# EAGLE design entireboard_v2_4layer (EAGLE 9.3.0)

## Sheet 1 of 2
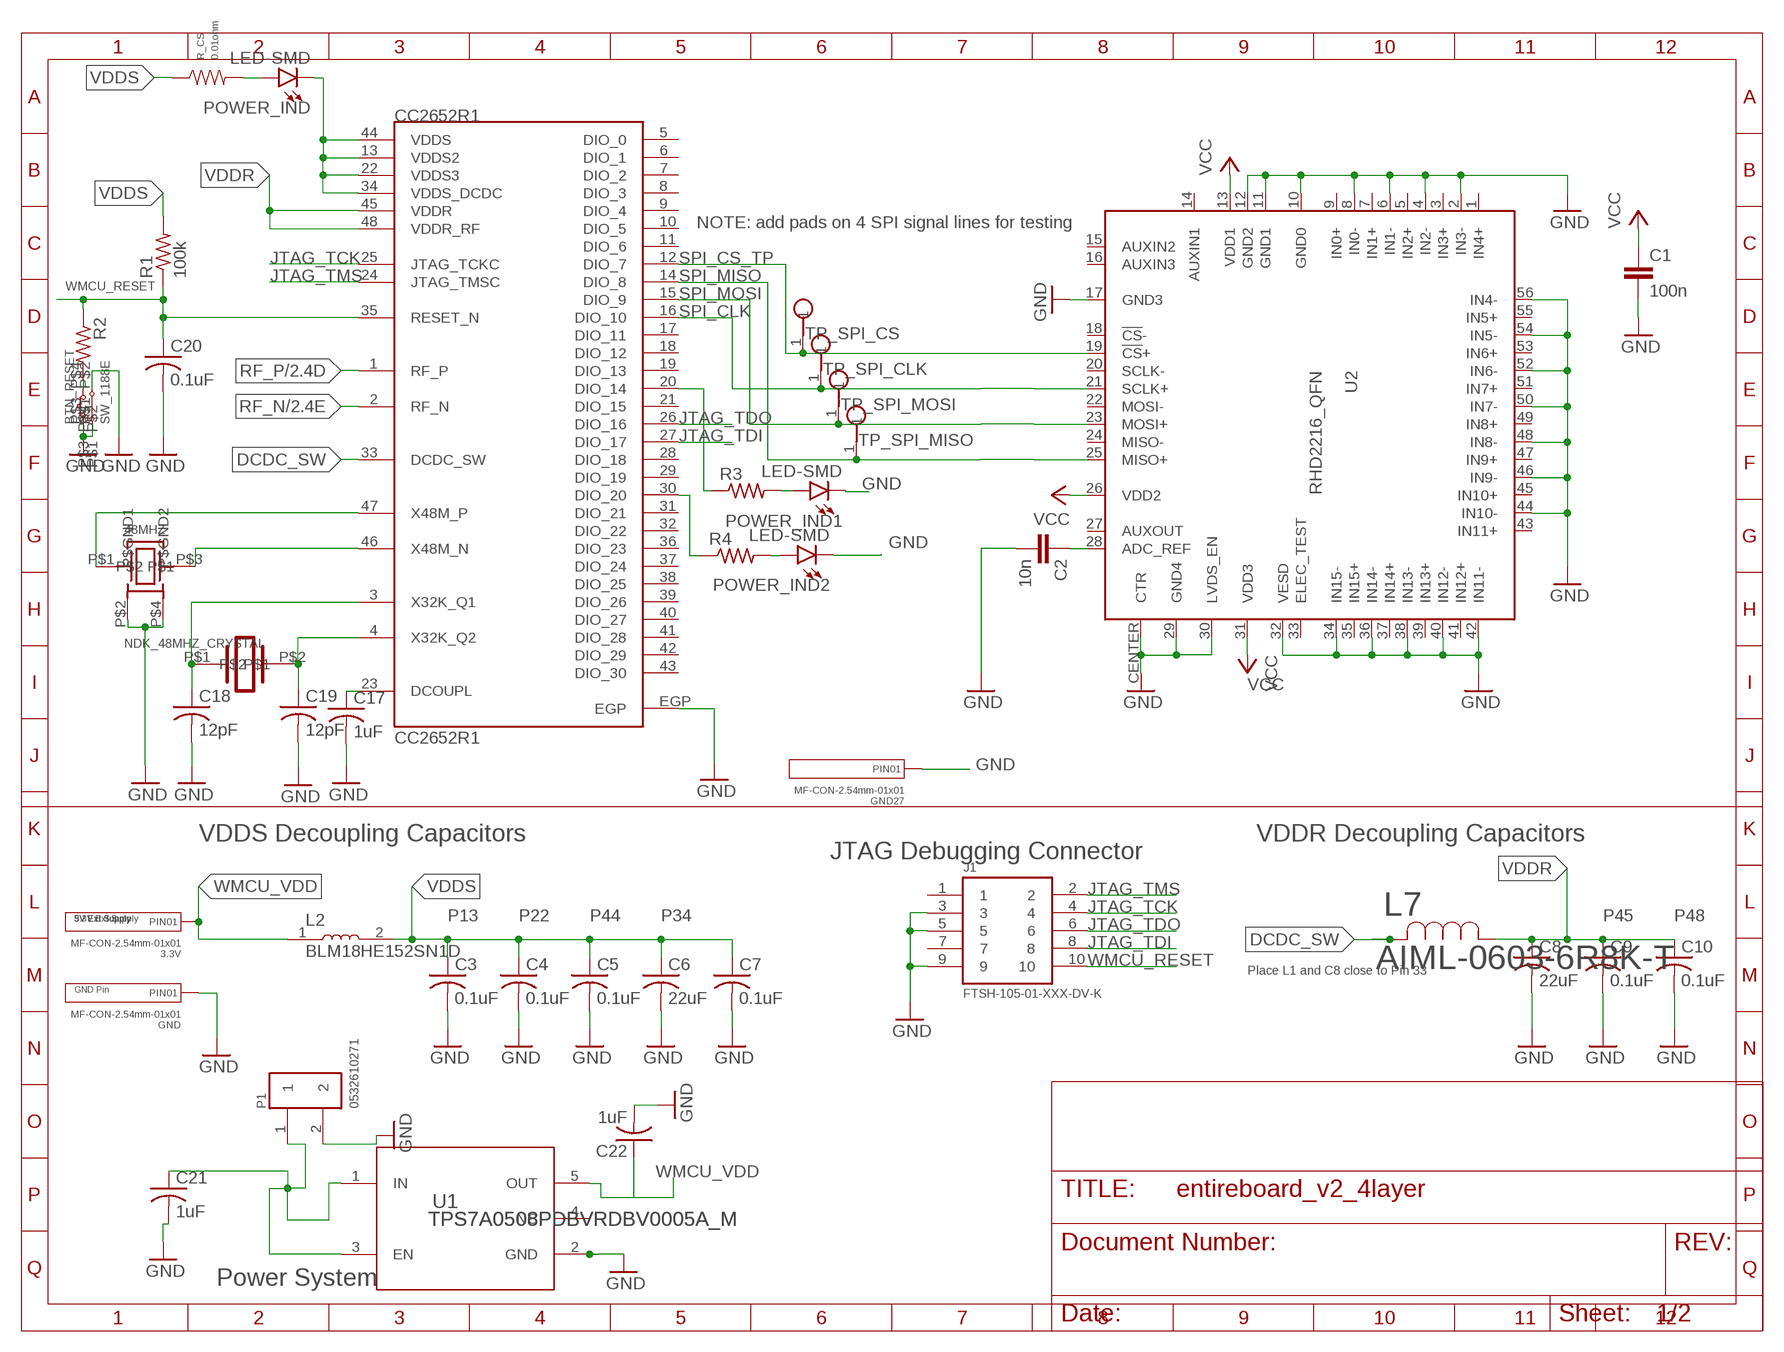
[diagram p0: schematic, sheet 1]

### Parts
3.3V  MF-CON-2.54mm-01x01  CON_01X01_PTH_2.54MM  [PTH_2.54MM_01X01]
38.768KHZ  EPSON_32.768KHZ_CRYSTAL  [2-SMD]
48MHZ  NDK_48MHZ_CRYSTAL  [4-SMD]
BTN_RESET  SW_1188E  [SW_1188E]
C1  100n  C_0402  [0402]
C2  10n  C_0402  [0402]
C3  0.1uF  C-USC0402  [C0402]
C4  0.1uF  C-USC0402  [C0402]
C5  0.1uF  C-USC0402  [C0402]
C6  22uF  C-USC0402  [C0402]
C7  0.1uF  C-USC0402  [C0402]
C8  22uF  C-USC0402  [C0402]
C9  0.1uF  C-USC0402  [C0402]
C10  0.1uF  C-USC0402  [C0402]
C17  1uF  C-USC0402  [C0402]
C18  12pF  C-USC0402  [C0402]
C19  12pF  C-USC0402  [C0402]
C20  0.1uF  C-USC0402  [C0402]
C21  1uF  C-USC0402  [C0402]
C22  1uF  C-USC0402  [C0402]
CC2652R1  CC2652R1  [CC2652R1_QFN-48]
GND  MF-CON-2.54mm-01x01  CON_01X01_PTH_2.54MM  [PTH_2.54MM_01X01]
GND27  MF-CON-2.54mm-01x01  CON_01X01_PTH_2.54MM  [PTH_2.54MM_01X01]
J1  FTSH-105-01-XXX-DV-K  [FTSH-105-01-XXX-DV-K]
L2  BLM18HE152SN1D  [INDC1608X95]
L7  AIML-0603-6R8K-T  [AIML-0603]
P1  0532610271  [MOLEX_0532610271]
POWER_IND  LED-SMD  [RHD2000_EVAL_BOARD_0402]
POWER_IND1  LED-SMD  [RHD2000_EVAL_BOARD_0402]
POWER_IND2  LED-SMD  [RHD2000_EVAL_BOARD_0402]
R1  100k  R-US_R0402  [R0402]
R2  R-US_R0402  [R0402]
R3  R-US_R0402  [R0402]
R4  R-US_R0402  [R0402]
R_CS  0.01ohm  RESISTOR_0402  [R0402]
TP_SPI_CLK  RHD2000_EVAL_BOARD_TESTPOINT_SMALL  [RHD2000_EVAL_BOARD_TESTPOINT_SMALL]
TP_SPI_CS  RHD2000_EVAL_BOARD_TESTPOINT_SMALL  [RHD2000_EVAL_BOARD_TESTPOINT_SMALL]
TP_SPI_MISO  RHD2000_EVAL_BOARD_TESTPOINT_SMALL  [RHD2000_EVAL_BOARD_TESTPOINT_SMALL]
TP_SPI_MOSI  RHD2000_EVAL_BOARD_TESTPOINT_SMALL  [RHD2000_EVAL_BOARD_TESTPOINT_SMALL]
U1  TPS7A0508PDBVRDBV0005A_M  [DBV0005A_M]
U2  RHD2216_QFN  [QFN56_8_X_8_LARGE]

### Nets
DCDC_SW: CC2652R1.33(DCDC_SW) L7.2
GND: 48MHZ.P$2(P$GND1) 48MHZ.P$4(P$GND2) BTN_RESET.P$1 BTN_RESET.P$2 BTN_RESET.P$3 C1.2 C2.2 C3.2 C4.2 C5.2 C6.2 C7.2 C8.2 C9.2 C10.2 C17.2 C18.2 C19.2 C20.2 C21.2 C22.2 CC2652R1.EGP GND27.P$1(PIN1) GND.P$1(PIN1) J1.3 J1.5 J1.9 P1.2 POWER_IND1.2(C) POWER_IND2.2(C) U1.2(GND) U2.2(IN3-) U2.4(IN2-) U2.6(IN1-) U2.8(IN0-) U2.10(GND0) U2.11(GND1) U2.12(GND2) U2.17(GND3) U2.29(GND4) U2.30(LVDS_EN) U2.32(VESD) U2.34(IN15-) U2.36(IN14-) U2.38(IN13-) U2.40(IN12-) U2.42(IN11-) U2.44(IN10-) U2.46(IN9-) U2.48(IN8-) U2.50(IN7-) U2.52(IN6-) U2.54(IN5-) U2.56(IN4-) U2.CENTER(CTR) ; also sheet 2
JTAG_TCK: CC2652R1.25(JTAG_TCKC) J1.4
JTAG_TDI: CC2652R1.27(DIO_17) J1.8
JTAG_TDO: CC2652R1.26(DIO_16) J1.6
JTAG_TMS: CC2652R1.24(JTAG_TMSC) J1.2
N$1: C17.1 CC2652R1.23(DCOUPL)
N$3: 48MHZ.P$1 CC2652R1.47(X48M_P)
N$4: 48MHZ.P$3 CC2652R1.46(X48M_N)
N$5: 38.768KHZ.P$1 C18.1 CC2652R1.3(X32K_Q1)
N$10: 38.768KHZ.P$2 C19.1 CC2652R1.4(X32K_Q2)
N$13: POWER_IND.1(A) R_CS.P$2
N$14: C21.1 P1.1 U1.1(IN) U1.3(EN)
N$16: BTN_RESET.P$4 R2.2
N$23: CC2652R1.20(DIO_14) R3.1
N$24: POWER_IND1.1(A) R3.2
N$25: CC2652R1.30(DIO_20) R4.1
N$26: POWER_IND2.1(A) R4.2
N$42: C2.1 U2.28(ADC_REF)
RF_N: CC2652R1.2(RF_N) ; also sheet 2
RF_P: CC2652R1.1(RF_P) ; also sheet 2
SPI_CLK: CC2652R1.16(DIO_10) TP_SPI_CLK.1 U2.21(SCLK+)
SPI_CS_TP: CC2652R1.12(DIO_7) TP_SPI_CS.1 U2.19(!CS!+)
SPI_MISO: CC2652R1.14(DIO_8) TP_SPI_MISO.1 U2.25(MISO+)
SPI_MOSI: CC2652R1.15(DIO_9) TP_SPI_MOSI.1 U2.23(MOSI+)
VCC: C1.1 U2.13(VDD1) U2.26(VDD2) U2.31(VDD3)
VDDR: C8.1 C9.1 C10.1 CC2652R1.45(VDDR) CC2652R1.48(VDDR_RF) L7.1
VDDS: C3.1 C4.1 C5.1 C6.1 C7.1 CC2652R1.13(VDDS2) CC2652R1.22(VDDS3) CC2652R1.34(VDDS_DCDC) CC2652R1.44(VDDS) L2.2 POWER_IND.2(C) R1.2 R_CS.P$1
WMCU_RESET: C20.1 CC2652R1.35(RESET_N) J1.10 R1.1 R2.1
WMCU_VDD: 3.3V.P$1(PIN1) C22.1 L2.1 U1.5(OUT)
Unconnected: CC2652R1.5(DIO_0) CC2652R1.6(DIO_1) CC2652R1.7(DIO_2) CC2652R1.8(DIO_3) CC2652R1.9(DIO_4) CC2652R1.10(DIO_5) CC2652R1.11(DIO_6) CC2652R1.17(DIO_11) CC2652R1.18(DIO_12) CC2652R1.19(DIO_13) CC2652R1.21(DIO_15) CC2652R1.28(DIO_18) CC2652R1.29(DIO_19) CC2652R1.31(DIO_21) CC2652R1.32(DIO_22) CC2652R1.36(DIO_23) CC2652R1.37(DIO_24) CC2652R1.38(DIO_25) CC2652R1.39(DIO_26) CC2652R1.40(DIO_27) CC2652R1.41(DIO_28) CC2652R1.42(DIO_29) CC2652R1.43(DIO_30) J1.1 J1.7 U2.1(IN4+) U2.3(IN3+) U2.5(IN2+) U2.7(IN1+) U2.9(IN0+) U2.14(AUXIN1) U2.15(AUXIN2) U2.16(AUXIN3) U2.18(!CS!-) U2.20(SCLK-) U2.22(MOSI-) U2.24(MISO-) U2.27(AUXOUT) U2.33(ELEC_TEST) U2.35(IN15+) U2.37(IN14+) U2.39(IN13+) U2.41(IN12+) U2.43(IN11+) U2.45(IN10+) U2.47(IN9+) U2.49(IN8+) U2.51(IN7+) U2.53(IN6+) U2.55(IN5+)

### Notes on the sheet
- NOTE: add pads on 4 SPI signal lines for testing
- VDDS Decoupling Capacitors | VDDR Decoupling Capacitors
- JTAG Debugging Connector
- 3.3V Ext Supply | 5V Ext Supply | 5V Ext Supply | P13 | P22 | P44 | P34 | P45 | P48
- Place L1 and C8 close to Pin 33
- GND Pin
- Power System

## Sheet 2 of 2
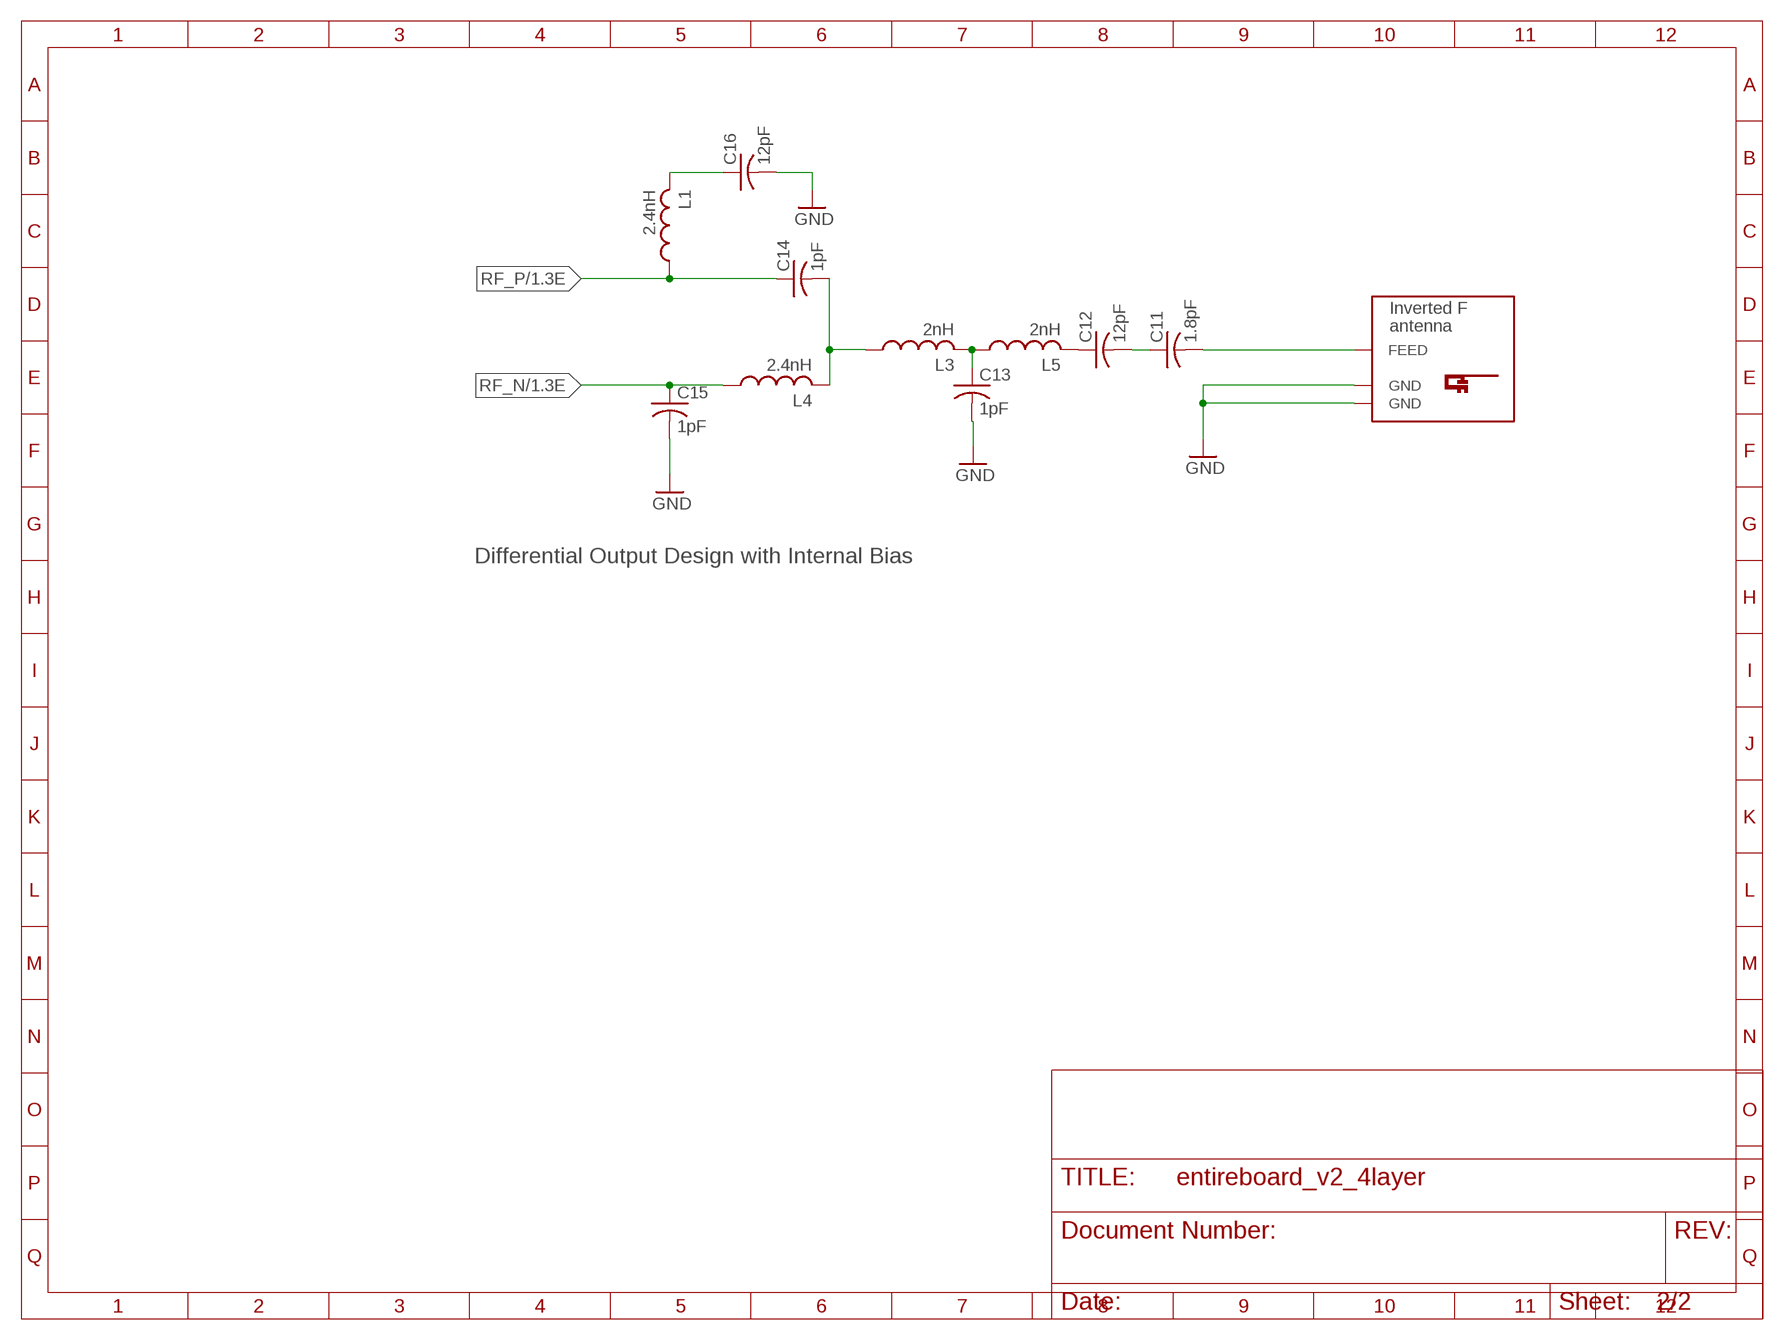
[diagram p1: schematic, sheet 2]

### Parts
C11  1.8pF  C-USC0402  [C0402]
C12  12pF  C-USC0402  [C0402]
C13  1pF  C-USC0402  [C0402]
C14  1pF  C-USC0402  [C0402]
C15  1pF  C-USC0402  [C0402]
C16  12pF  C-USC0402  [C0402]
L1  2.4nH  L-USL0201  [L0201]
L3  2nH  L-USL0201  [L0201]
L4  2.4nH  L-USL0201  [L0201]
L5  2nH  L-USL0201  [L0201]
U$2  INVERTED_F_ANTENNA+0  [DN007+0]

### Nets
GND: C13.2 C15.2 C16.2 U$2.GND U$2.GND@1(GND) ; also sheet 1
N$6: C11.1 C12.2
N$7: C12.1 L5.2
N$8: C13.1 L3.2 L5.1
N$9: C14.2 L3.1 L4.2
N$11: C11.2 U$2.FEED
N$12: C16.1 L1.2
RF_N: C15.1 L4.1 ; also sheet 1
RF_P: C14.1 L1.1 ; also sheet 1

### Notes on the sheet
- Differential Output Design with Internal Bias

## Power pins joined to a net without a drawn wire
NC: U1.4(NC)

## Library data of the parts
3.3V GND GND27 = AxonMobile:CON_01X01: Library: MF_Connectors Description: Header Connector with 01 Positions and 01 Rows. Use the LABEL Attribute to label the pin on the schematic and PCB. You can remove the attributes on the PCB by using the SMASH function on the part and then deleting the text.; HOUSEPART: YES; MPN: MF-CON-2.54mm-01x01; POPULATE: 1; URL: https://factory.macrofab.com/part/MF-CON-2.54mm-01x01
38.768KHZ = AxonMobile:EPSON_32.768KHZ_CRYSTAL
48MHZ = AxonMobile:NDK_48MHZ_CRYSTAL
BTN_RESET = AxonMobile:SW_1188E
C1 C2 = RHD2000_eval_board:C: Capacitor
C3-C22 = adafruit:C-US: CAPACITOR, American symbol
CC2652R1 = AxonMobile:CC2652R1: TI CC2652R1 SimpleLink Multi-Standard Wireless MCU
J1 = AxonMobile:FTSH-105-01-XXX-DV-K: 0.05"x0.05" DOUBLE ROW SMT STRIP ASSEMBLY. MANUFACTURER:SAMTEC.
L1 L3-L5 = rcl-2:L-US: INDUCTOR, American symbol
L2 = BLM18HE152SN1D:BLM18HE152SN1D: Ferrite Beads Multi-Layer 1.5KOhm 25% 100MHz 500mA 500mOhm DCR 0603 T/R; DIGI-KEY_PART_NUMBER: 490-5216-1-ND; DIGI-KEY_PURCHASE_URL: https://www.digikey.com/product-detail/en/murata-electronics-north-america/BLM18HE152SN1D/490-5216-1-ND/1948392?utm_source=snapeda&utm_medium=aggregator&utm_campaign=symbol; MF: Murata Electronics; MP: BLM18HE152SN1D; PACKAGE: 0603 Samtec
L7 = inductor_0603:AIML-0603-6R8K-T; MANUFACTURER_PART_NUMBER: AIML06036R8KT; VENDOR: Abracon
P1 = 0532610271:0532610271: 1.25mm (.049") Pitch PicoBlade Header, Surface Mount, Right Angle, Lead-free, 2 Circuits; DESCRIPTION: 1.25mm _.049_ Pitch PicoBlade Header, Surface Mount, Right Angle, Lead-free, 2 Circuits; DIGI-KEY_PART_NUMBER: WM7620CT-ND; DIGI-KEY_PURCHASE_URL: https://www.digikey.com/product-detail/en/molex-llc/0532610271/WM7620CT-ND/699107?utm_source=snapeda&utm_medium=aggregator&utm_campaign=symbol; MF: Molex, LLC; MP: 0532610271; PACKAGE: None
POWER_IND POWER_IND1 POWER_IND2 = AxonMobile:LED-SMD
R1-R4 = AxonMobile:R-US_: RESISTOR, American symbol; SPICEPREFIX: R
R_CS = MF_Passives:RESISTOR: Library: MF_Passives Description: Device for Resistors. Manufacture part number (MPN), Voltage, Tolerance, and Wattage Rating can be added via Attributes. Check https://factory.macrofab.com/parts for the house parts list.; POPULATE: 1
TP_SPI_CLK TP_SPI_CS TP_SPI_MISO TP_SPI_MOSI = AxonMobile:RHD2000_EVAL_BOARD_TESTPOINT: PCB Test Point
U1 = yka0004:TPS7A0508PDBVR
U2 = RHD2000:RHD2216: Intan Technologies RHD2216 chip
U$2 = antenna:INVERTED_F_ANTENNA: 2.4GHz Inverted F Antenna Based on TI Design Note DN007

## Net classes
1 thick: width 1.016 mm
2 power: width 0.61 mm

## Board
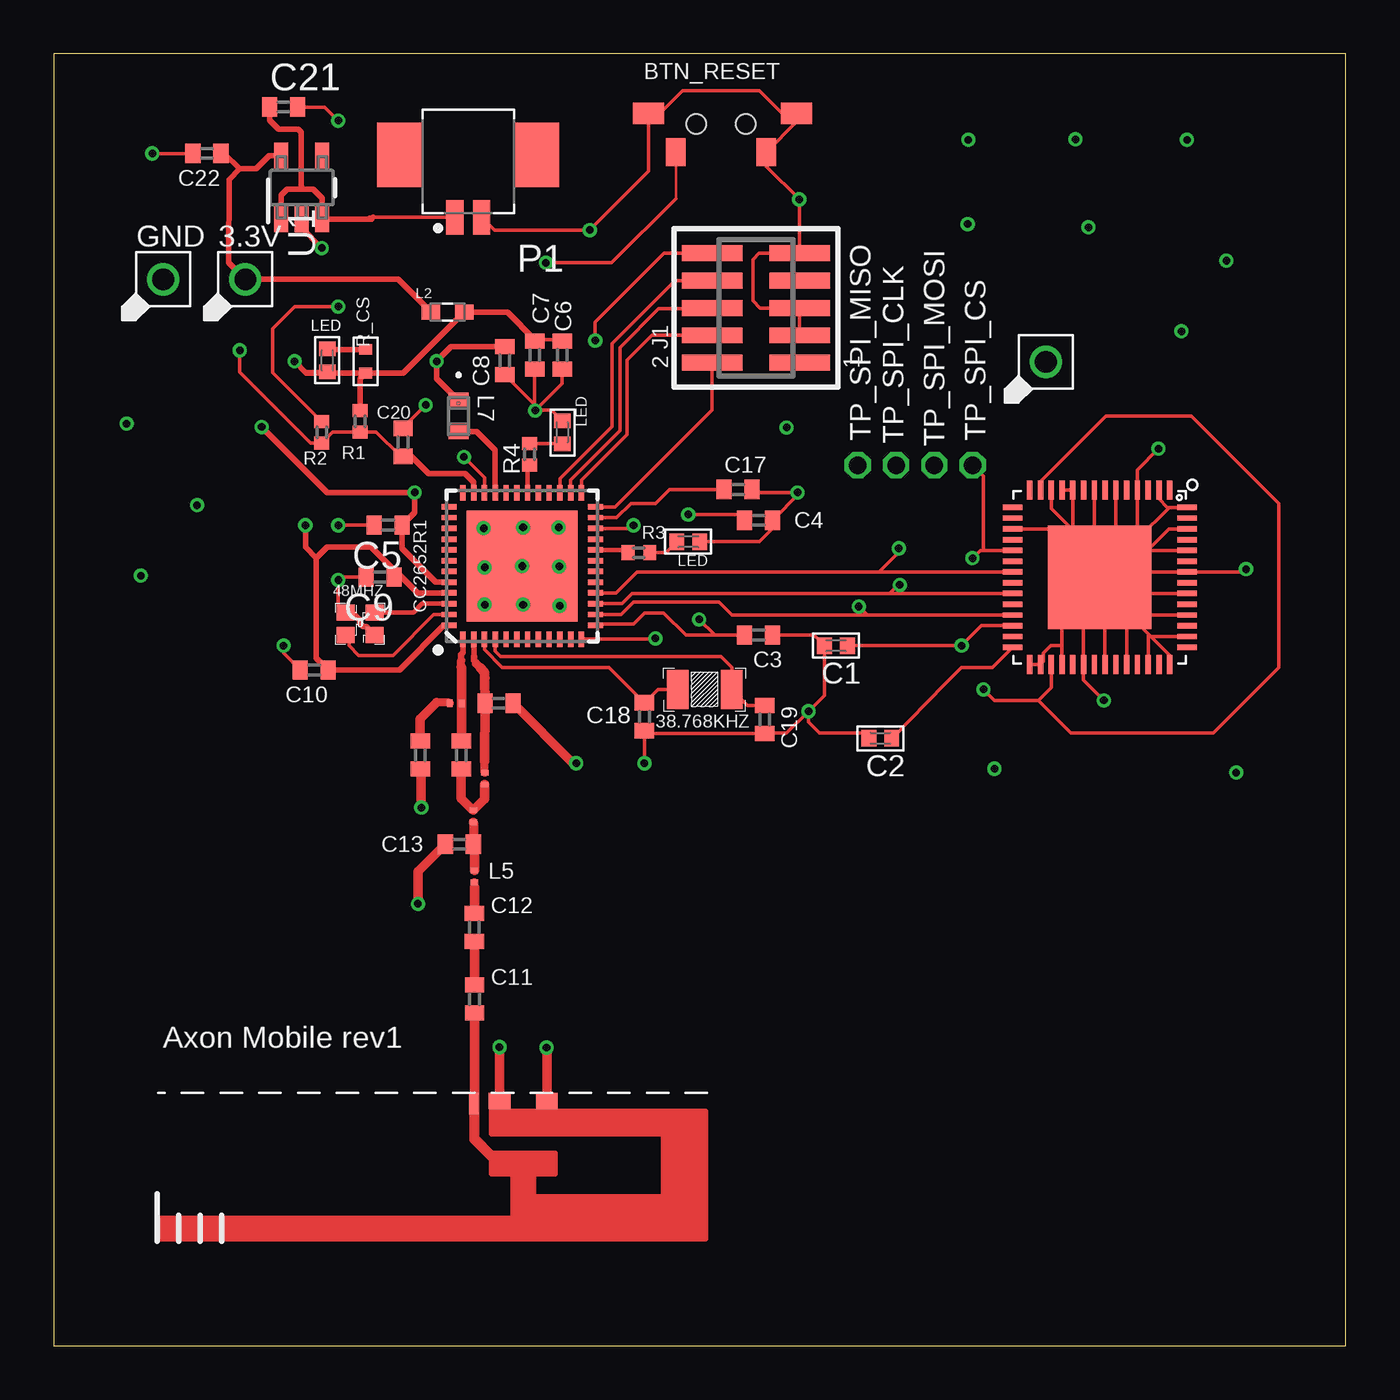
[diagram p2: board, top side]
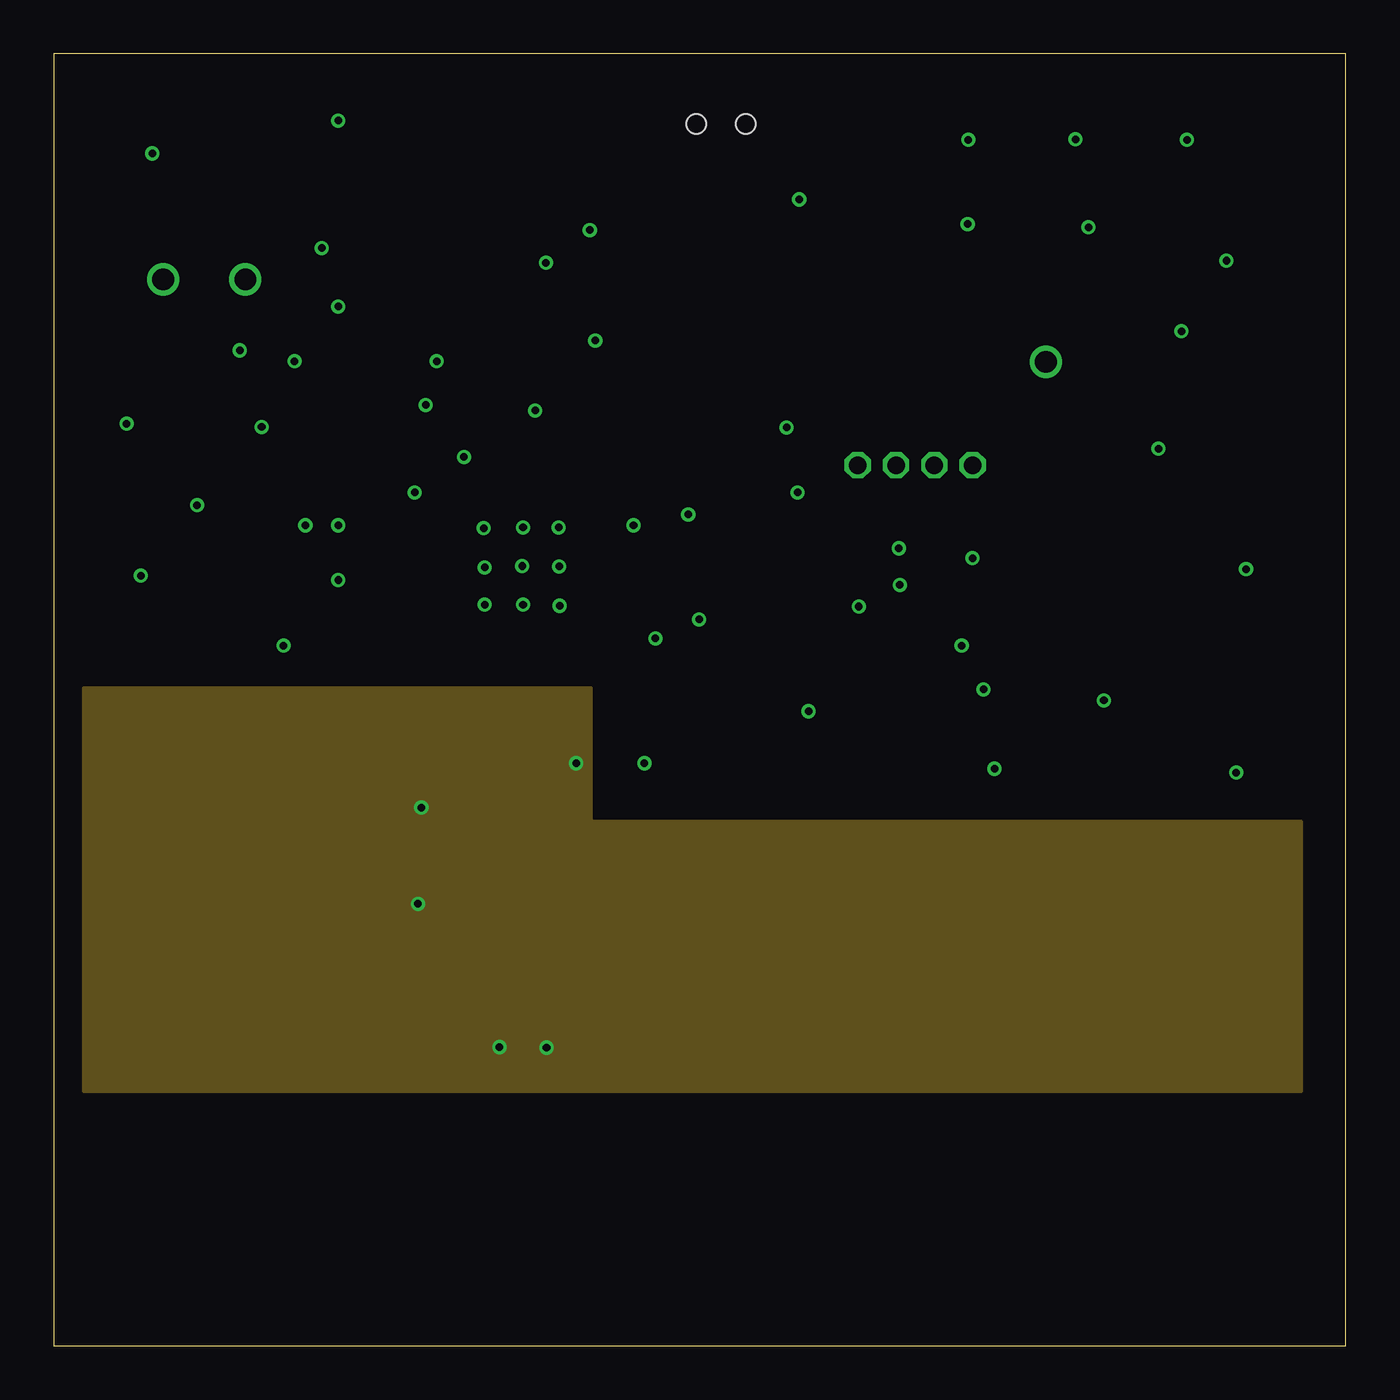
[diagram p3: board, inner layer Route2]
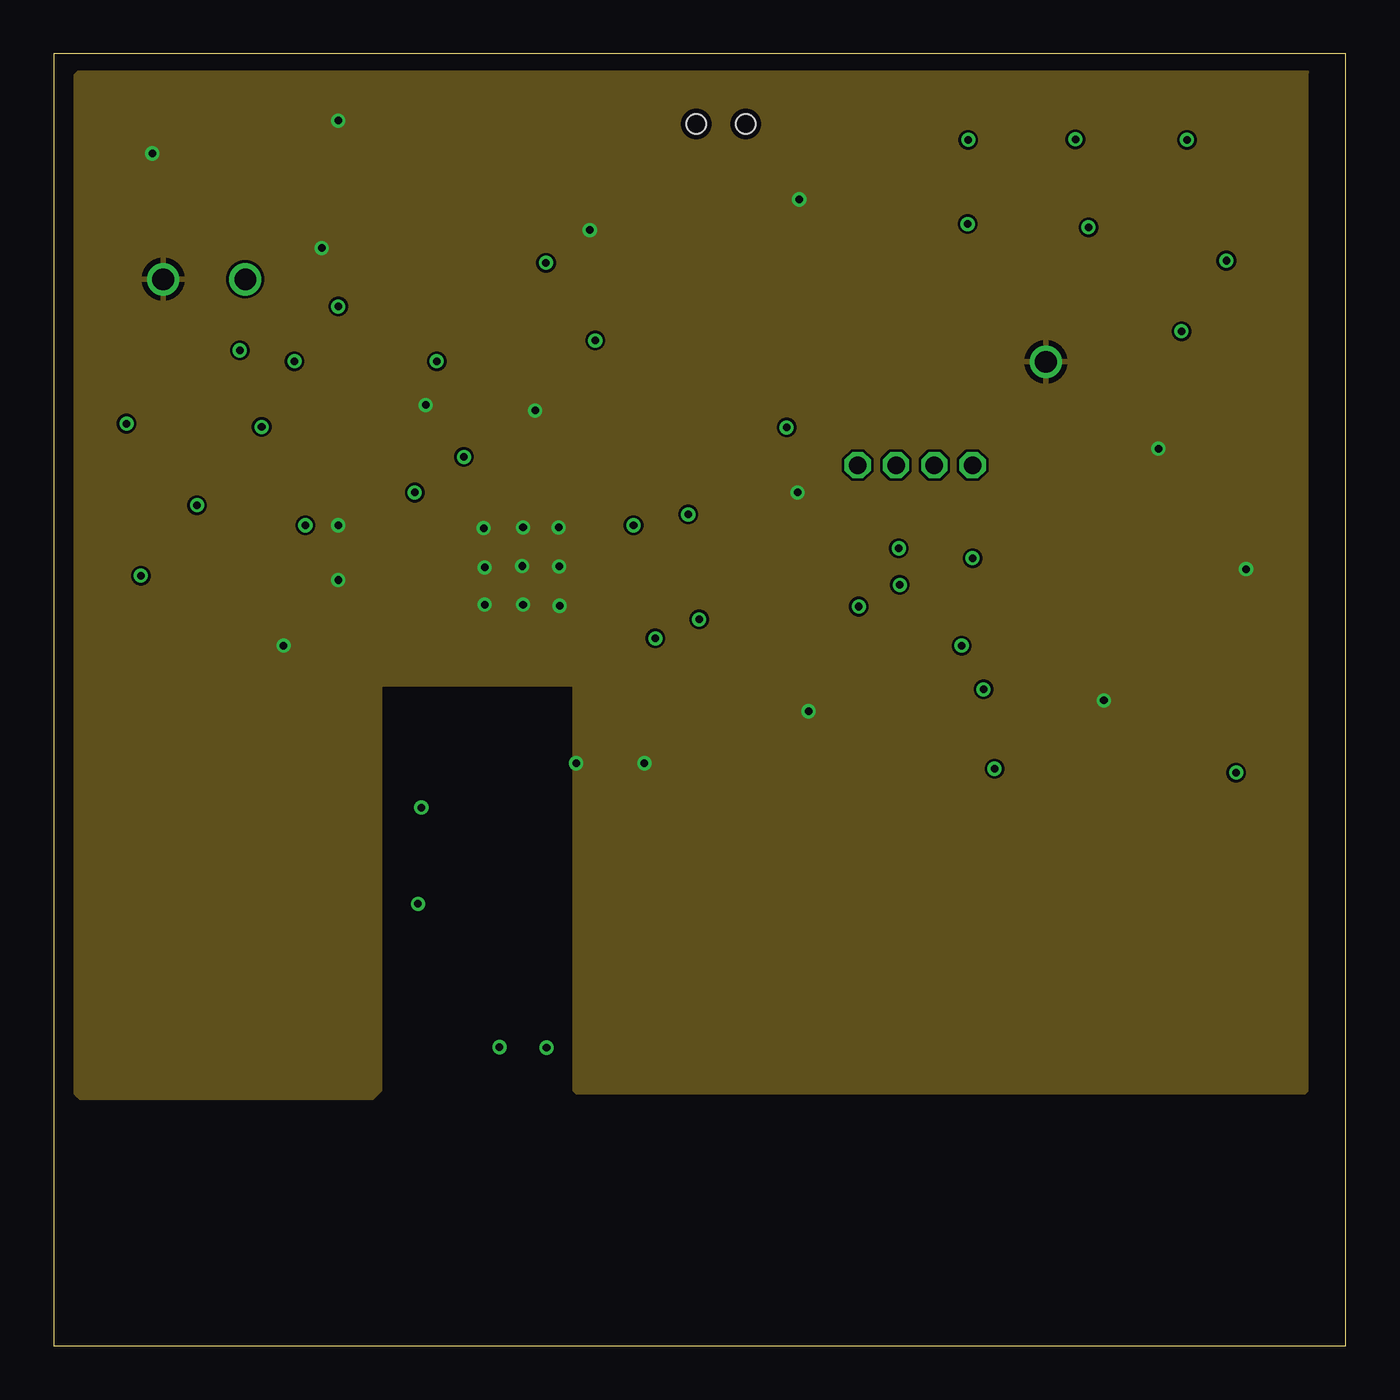
[diagram p4: board, inner layer Route15]
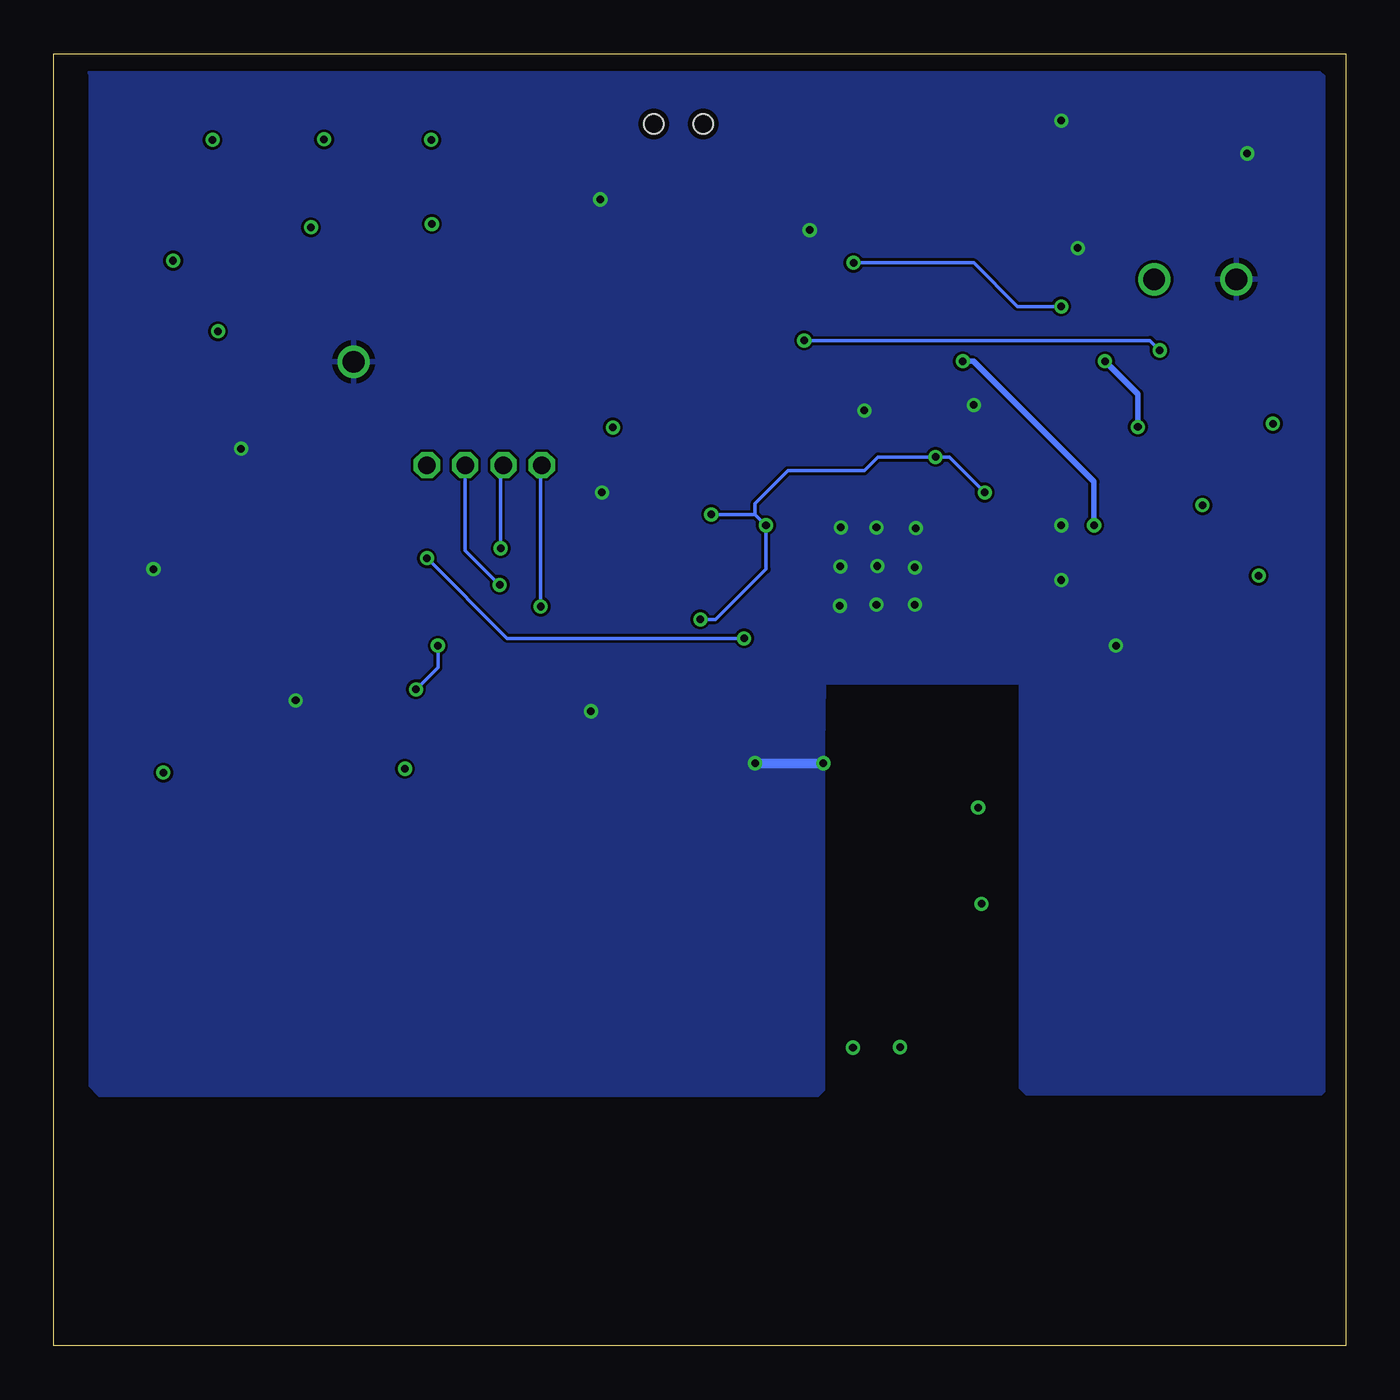
[diagram p5: board, bottom side, seen from below]

Size 60 x 60 mm. Coordinates in mm from the lower left corner, seen from the top.
Outline: 0,0 60,0 60,60 0,60 0,0
Copper layers (1*2*15*16): Top 0.035mm / dielectric 0.23mm / Route2 0.035mm / dielectric 0.93mm / Route15 0.035mm / dielectric 0.23mm / Bottom 0.035mm
Design rules "MF_Standard_4_Layer": minimum track width 5mil, minimum drill 12mil, track to track 5mil, track to pad 5mil, pad to pad 5mil, via to via 5mil, smd to smd 0mil, copper to edge 10mil, drill to drill 10mil, minimum pad ring 6mil, minimum via ring 6mil, stop-mask expansion 2mil, vias tented up to drill 25mil, thermal gap 10mil

### Footprints (pad centres in the part's own frame; a part is rotated, then mirrored left to right if it is on the bottom)
PTH_2.54MM_01X01 = drill 1: P$1 0,0
2-SMD = smd 1 x 1.8: P$1 -1.25,0; P$2 1.25,0
4-SMD = smd 0.85 x 0.75: P$1 -0.675,-0.525; P$2 0.675,-0.525; P$3 0.675,0.525; P$4 -0.675,0.525
SW_1188E = smd 1.45 x 1: P$1 -3.5,-0.5; P$2 3.375,-0.5 | smd 0.9 x 1.3: P$3 -2.1,1.3; P$4 2.1,1.3 | hole 0.9: 1.15,0; -1.15,0
0402 = smd 0.686 x 0.762: 1 -0.533,0; 2 0.533,0
C0402 = smd 0.7 x 0.9: 1 -0.65,0; 2 0.65,0
CC2652R1_QFN-48 = smd 0.7 x 0.25: 1 -3.4,2.75; 2 -3.4,2.25; 3 -3.4,1.75; 4 -3.4,1.25; 5 -3.4,0.75; 6 -3.4,0.25; 7 -3.4,-0.25; 8 -3.4,-0.75; 9 -3.4,-1.25; 10 -3.4,-1.75; 11 -3.4,-2.25; 12 -3.4,-2.75; 25 3.4,-2.75; 26 3.4,-2.25; 27 3.4,-1.75; 28 3.4,-1.25; 29 3.4,-0.75; 30 3.4,-0.25; 31 3.4,0.25; 32 3.4,0.75; 33 3.4,1.25; 34 3.4,1.75; 35 3.4,2.25; 36 3.4,2.75 | smd 0.25 x 0.7: 13 -2.75,-3.4; 14 -2.25,-3.4; 15 -1.75,-3.4; 16 -1.25,-3.4; 17 -0.75,-3.4; 18 -0.25,-3.4; 19 0.25,-3.4; 20 0.75,-3.4; 21 1.25,-3.4; 22 1.75,-3.4; 23 2.25,-3.4; 24 2.75,-3.4; 37 2.75,3.4; 38 2.25,3.4; 39 1.75,3.4; 40 1.25,3.4; 41 0.75,3.4; 42 0.25,3.4; 43 -0.25,3.4; 44 -0.75,3.4; 45 -1.25,3.4; 46 -1.75,3.4; 47 -2.25,3.4; 48 -2.75,3.4 | smd 5.15 x 5.15: EGP 0,0
FTSH-105-01-XXX-DV-K = smd 0.737 x 2.794: 1 -2.54,-2.032; 2 -2.54,2.032; 3 -1.27,-2.032; 4 -1.27,2.032; 5 0,-2.032; 6 0,2.032; 7 1.27,-2.032; 8 1.27,2.032; 9 2.54,-2.032; 10 2.54,2.032
L0201 = smd 0.25 x 0.35: 1 -0.275,0; 2 0.275,0
INDC1608X95 = smd 0.85 x 0.7: 1 -0.775,0; 2 0.775,0
AIML-0603 = smd 0.711 x 0.914: 1 -0.724,0; 2 0.724,0
MOLEX_0532610271 = smd 0.8 x 1.6: 1 0.625,0; 2 -0.625,0 | smd 2.1 x 3: 3 -3.175,-2.9; 4 3.175,-2.9
RHD2000_EVAL_BOARD_0402 = smd 0.686 x 0.762: 1 -0.533,0; 2 0.533,0
R0402 = smd 0.6 x 0.7: 1 -0.5,0; 2 0.5,0
R0402' = smd 0.5 x 0.6: P$1 -0.55,0; P$2 0.55,0
RHD2000_EVAL_BOARD_TESTPOINT_SMALL = drill 0.813 octagon: 1 0,0
DBV0005A_M = smd 1.2 x 0.65: 1 -1.475,0.95; 2 -1.475,0; 3 -1.475,-0.95; 4 1.475,-0.95; 5 1.475,0.95
QFN56_8_X_8_LARGE = smd 0.9 x 0.25: 1 -4.05,3.25; 2 -4.05,2.75; 3 -4.05,2.25; 4 -4.05,1.75; 5 -4.05,1.25; 6 -4.05,0.75; 7 -4.05,0.25; 8 -4.05,-0.25; 9 -4.05,-0.75; 10 -4.05,-1.25; 11 -4.05,-1.75; 12 -4.05,-2.25; 13 -4.05,-2.75; 14 -4.05,-3.25; 29 4.05,-3.25; 30 4.05,-2.75; 31 4.05,-2.25; 32 4.05,-1.75; 33 4.05,-1.25; 34 4.05,-0.75; 35 4.05,-0.25; 36 4.05,0.25; 37 4.05,0.75; 38 4.05,1.25; 39 4.05,1.75; 40 4.05,2.25; 41 4.05,2.75; 42 4.05,3.25 | smd 0.25 x 0.9: 15 -3.25,-4.05; 16 -2.75,-4.05; 17 -2.25,-4.05; 18 -1.75,-4.05; 19 -1.25,-4.05; 20 -0.75,-4.05; 21 -0.25,-4.05; 22 0.25,-4.05; 23 0.75,-4.05; 24 1.25,-4.05; 25 1.75,-4.05; 26 2.25,-4.05; 27 2.75,-4.05; 28 3.25,-4.05; 43 3.25,4.05; 44 2.75,4.05; 45 2.25,4.05; 46 1.75,4.05; 47 1.25,4.05; 48 0.75,4.05; 49 0.25,4.05; 50 -0.25,4.05; 51 -0.75,4.05; 52 -1.25,4.05; 53 -1.75,4.05; 54 -2.25,4.05; 55 -2.75,4.05; 56 -3.25,4.05 | smd 4.8 x 4.8: CENTER 0,0
DN007+0 = smd 0.46 x 1: FEED 2.22,-2.8 | smd 1.01 x 0.74: GND -1.16,-2.93; GND@1 1.035,-2.93

### Placement (x,y rotation side)
3.3V  8.89,49.53 0 top
38.768KHZ  30.23,30.48 0 top
48MHZ  14.22,33.53 0 top
BTN_RESET  30.99,56.74 180 top
C1  36.32,32.51 180 top
C2  38.39,28.21 180 top
C3  32.73,33.01 0 top
C4  32.73,38.34 0 top
C5  15.53,38.11 180 top
C6  23.61,46.01 270 top
C7  22.34,46.01 270 top
C8  20.94,45.75 270 top
C9  15.14,35.7 180 top
C10  12.1,31.38 180 top
C11  19.54,16.1 270 top
C12  19.53,19.43 270 top
C13  18.83,23.29 180 top
C14  18.92,27.43 270 top
C15  20.68,29.84 0 top
C16  17.02,27.43 270 top
C17  31.78,39.77 0 top
C18  27.43,29.21 270 top
C19  33.02,29.08 270 top
C20  16.22,41.96 90 top
C21  10.67,57.53 0 top
C22  7.11,55.37 180 top
CC2652R1  21.75,36.21 90 top
GND  5.08,49.53 0 top
GND27  46.08,45.69 0 top
J1  32.61,48.2 90 top
L1  18.67,29.84 180 top
L2  18.29,48.01 0 top
L3  19.48,24.59 270 top
L4  20.02,26.34 270 top
L5  19.53,21.79 270 top
L7  18.8,43.18 270 top
P1  19.25,52.4 180 top
POWER_IND  12.7,45.77 270 top
POWER_IND1  29.46,37.34 0 top
POWER_IND2  23.62,42.42 90 top
R1  14.22,42.93 90 top
R2  12.45,42.42 90 top
R3  27.18,36.83 0 top
R4  22.1,41.4 90 top
R_CS  0.01ohm  [R0402']  14.48,45.72 90 top
TP_SPI_CLK  39.12,40.89 0 top
TP_SPI_CS  42.67,40.89 0 top
TP_SPI_MISO  37.34,40.89 0 top
TP_SPI_MOSI  40.89,40.89 0 top
U1  11.51,53.8 90 top
U2  48.58,35.69 270 top
U$2  21.74,8.45 180 top

### Tracks (layer width: path | path; a pad name or v marks a point on that pad's centre or on a via)
DCDC_SW
  Top 0.254: CC2652R1.33 20.5,41.6 19.64,42.46 L7.2
GND  (via drill 0.35)
  Top 0.152: U2.29 U2.30 45.97,31.78 45.97,32.18 46.3,32.51 46.83,32.51 | U2.32 46.83,32.51 | 46.83,32.51 46.83,33.94 47.83,34.94 | 47.83,34.94 U2.34 47.83,30.91 v48.77,29.97 | 47.83,34.94 U2.CENTER | U2.36 48.83,35.05 | 48.83,35.05 48.83,35.44 U2.CENTER | 49.83,34.05 48.94,34.94 | U2.40 50.83,33.05 | 50.83,33.05 49.94,33.94 | U2.42 51.83,32.05 50.94,32.94 | U2.44 50.94,32.94 | 50.94,32.94 50.83,33.05 | U2.46 49.94,33.94 | 49.94,33.94 49.83,34.05 | U2.48 48.94,34.94 | 48.94,34.94 48.83,35.05 | v55.37,36.07 55.24,35.94 U2.50 49.78,35.94 | 49.78,35.94 49.28,35.94 | 49.28,35.94 48.83,35.94 U2.CENTER | U2.52 50.78,36.94 | 50.78,36.94 50.36,36.51 | 50.36,36.51 49.78,35.94 | U2.54 51.78,37.94 50.78,36.94 | U2.56 51.82,38.94 | 51.82,38.94 51.73,38.94 51.33,39.34 U2.2 | 51.82,38.94 50.36,37.48 | 50.36,37.48 50.36,36.51 | 50.36,37.48 50.33,37.51 U2.4 50.33,40.67 v51.31,41.66 | U2.6 49.33,35.99 49.28,35.94 | U2.8 48.33,36.89 | 48.33,36.89 49.28,35.94 | 47.33,37.89 U2.10 U2.11 | 47.33,37.89 48.33,36.89 | U2.12 46.33,38.89 47.28,37.94 | U2.17 47.28,37.94 | 47.28,37.94 47.33,37.89 | C18.2 27.56,28.43 C19.2 33.03,28.45 34.04,28.45 v35.05,29.46 | C2.2 37.61,28.45 35.56,28.45 35.05,28.96 v35.05,29.46 | v35.05,29.46 35.79,30.2 C1.2 35.3,33.01 C3.2 | 13.78,34.05 48MHZ.P$4 13.21,34.39 v13.21,35.56 13.35,35.7 C9.2 | C10.2 10.67,32.16 v10.67,32.51 | C5.2 13.22,38.11 v13.21,38.1 | C17.2 32.57,39.62 v34.54,39.62 34.54,39.5 33.46,38.42 | v13.21,56.9 12.57,57.53 C21.2 | C22.2 v4.57,55.37 | P1.2 20.46,51.82 v24.89,51.82 27.61,54.54 BTN_RESET.P$2 28.16,57.24 29.2,58.28 32.78,58.28 33.82,57.24 BTN_RESET.P$1 34.49,56.84 BTN_RESET.P$3 33.09,54.77 v34.62,53.24 34.62,50.76 J1.9 32.75,50.74 32.46,50.44 32.46,48.54 32.8,48.2 J1.5 J1.3
  Top 0.152: C20.2 16.22,42.64 v17.27,43.69 | C18.2 27.43,28.19 | U2.38 49.83,34.05 | C4.2 33.46,38.42 | POWER_IND1.2 32.77,37.34 33.46,38.03 33.46,38.42 | C7.2 22.34,43.7 | 22.34,43.45 v22.35,43.43 23.61,44.69 C6.2 | 22.34,43.7 C8.2 | 22.34,43.7 22.34,43.45 | POWER_IND2.2 23.12,43.45 22.34,43.45 | C16.2 17.07,26.73 | C18.2 v27.43,27.05 | 24.12,27.05 v24.26,27.05
  Top 0.254: 48MHZ.P$4 13.85,34.05 14.2,33.71 14.2,33.56 14.36,33.4 14.5,33.4 48MHZ.P$2 | v20.71,13.86 v20.7,13.87 | 22.9,13.83 v22.89,13.84 | U1.2 11.51,51.92 v12.45,50.98
  Top 0.445: 17.07,26.73 v17.07,24.99 | C13.2 16.92,22.02 v16.92,20.52 | C15.2 24.12,27.05 | U$2.GND@1 v20.71,13.86 | U$2.GND 22.9,13.83
  Bottom 0.445: v24.26,27.05 v27.43,27.05
  other vias: 21.75,36.21 19.96,37.97 21.79,38 23.44,38 20.02,36.14 23.47,36.2 20.02,34.42 21.79,34.42 23.5,34.37
  pour Route2: 1.4,30.56 24.94,30.56 24.94,24.36 57.94,24.36 57.94,11.81 1.4,11.81
  pour Bottom: 24.26,27.81 24.26,11.89 24.51,11.63 57.89,11.63 58.32,12.06 58.32,59.08 58.37,59.13 1.19,59.13 1.02,58.95 1.02,11.81 1.14,11.68 14.83,11.68 15.11,11.96 15.11,30.76 15.14,30.78 24.21,30.78
  pour Route15: 24.28,11.73 58.09,11.73 58.19,11.84 58.19,59.11 58.24,59.16 1.14,59.16 0.99,59 0.99,11.71 1.07,11.63 1.22,11.48 14.81,11.48 15.19,11.86 15.19,30.63 15.24,30.68 24.16,30.68 24.16,11.86
JTAG_TCK
  Top 0.152: CC2652R1.25 24.5,40.2 26.62,42.32 26.62,45.77 27.77,46.93 J1.4
JTAG_TDI
  Top 0.152: CC2652R1.27 23.5,40.27 25.93,42.7 25.93,46.53 28.88,49.48 28.89,49.47 J1.8
JTAG_TDO
  Top 0.152: CC2652R1.26 24,40.21 26.29,42.49 26.29,46.35 28.09,48.16 30.54,48.16 J1.6
JTAG_TMS
  Top 0.152: CC2652R1.24 26.04,38.96 26.06,38.94 30.58,43.45 J1.2
N$1
  Top 0.152: C17.1 28.59,39.77 27.94,39.12 26.8,39.12 26.14,38.46 CC2652R1.23
N$2  (via drill 0.35)
  other vias: 4.04,35.76
N$3
  Top 0.152: 48MHZ.P$1 13.72,32.84 13.72,32.51 14.17,32.06 15.75,32.06 17.64,33.96 CC2652R1.47
N$4
  Top 0.203: CC2652R1.46 17.11,34.46 16.7,34.05 48MHZ.P$3
N$5
  Top 0.152: 38.768KHZ.P$1 28.05,30.48 C18.1 25.8,31.5 20.83,31.5 20,32.32 CC2652R1.3
N$6
  Top 0.152: 19.54,16.84 C11.1
  Top 0.254: C12.2 19.54,18.78
  Top 0.445: 19.54,18.78 19.54,16.84
N$7
  Top 0.254: C12.1
  Top 0.381: 19.53,21.01 19.53,21.31 L5.2
  Top 0.445: C12.1 19.53,21.31
N$8
  Top 0.152: L3.2
  Top 0.419: L3.2 C13.1 19.53,23.25
  Top 0.445: L5.1 19.53,23.25
N$9
  Top 0.419: 18.92,25.42 L3.1 20.02,25.4
  Top 0.445: C14.2 18.92,25.42 | L4.2 20.02,25.4
N$10
  Top 0.152: 38.768KHZ.P$2 | 38.768KHZ.P$2 32.22,29.73 C19.1 | 38.768KHZ.P$2 31.49,31.51 30.99,32 20.75,32 20.5,32.25 CC2652R1.4
N$11
  Top 0.152: 19.54,11.38 19.54,11.27 U$2.FEED
  Top 0.445: C11.2 19.54,11.38
N$12
  Top 0.381: L1.2 18.37,29.87 17.78,29.87
  Top 0.445: C16.1 17.02,29.11 17.78,29.87
N$13
  Top 0.254: POWER_IND.1 12.73,46.27 R_CS.P$2
N$14
  Top 0.152: 9.91,57.43 C21.1 | 14.65,52.4 14.83,52.4 P1.1
  Top 0.254: U1.1 10.56,53.43 10.85,53.72 11.61,53.72 | 11.61,53.72 12.04,53.72 12.46,53.3 U1.3 14.75,52.32 14.83,52.4 | 11.61,53.72 11.48,53.85 11.48,56.36 11.35,56.49 10.44,56.49 10.02,56.91 C21.1
N$15  (via drill 0.35)
  other vias: 6.65,39.04
N$16  (via drill 0.35)
  Top 0.127: 28.89,53.27 BTN_RESET.P$4
  Top 0.152: R2.2 10.16,45.2 10.16,47.24 11.18,48.26 v13.21,48.26 | 28.89,53.27 25.91,50.29 v22.86,50.29
  Bottom 0.152: v13.21,48.26 15.24,48.26 17.27,50.29 v22.86,50.29
N$17  (via drill 0.35)
  other vias: 3.38,42.82
N$18  (via drill 0.35)
  other vias: 52.37,47.12
N$19  (via drill 0.35)
  other vias: 54.46,50.39
N$20  (via drill 0.35)
  other vias: 48.06,51.94
N$21  (via drill 0.35)
  other vias: 52.63,56.01
N$22  (via drill 0.35)
  other vias: 42.47,56.01
N$23
  Top 0.203: CC2652R1.20 26.55,36.96 R3.1
N$24
  Top 0.152: R3.2 28.42,36.83 POWER_IND1.1
N$25
  Top 0.203: CC2652R1.30 22,40.81 R4.1
N$26
  Top 0.152: R4.2 23.61,41.9 POWER_IND2.1
N$29  (via drill 0.35)
  other vias: 34.04,42.65
N$30  (via drill 0.35)
  other vias: 47.45,56.03
N$31  (via drill 0.35)
  other vias: 42.44,52.1
N$32  (via drill 0.35)
  other vias: 43.69,26.8
N$33  (via drill 0.35)
  other vias: 54.91,26.62
N$42
  Top 0.152: C2.1 41.42,30.75 42.16,31.5 43.58,31.5 U2.28
RF_N
  Top 0.254: CC2652R1.2 19.51,32
  Top 0.305: 19.61,31.73 19.51,31.83 19.51,32
  Top 0.381: 19.79,31.5 19.61,31.67 19.61,31.73 | L4.1 20.02,27.13
  Top 0.445: 20.03,31 20.02,31.01 | 20.02,31.01 20.02,31.27 19.79,31.5 | 20.02,27.13 C15.1 20.02,31.01
RF_P
  Top 0.254: 18.92,32.11 19,32.19 CC2652R1.1
  Top 0.305: 18.92,31.83 18.92,32.11
  Top 0.381: 18.92,31.52 18.92,31.83
  Top 0.445: 18.92,31.52 18.94,31.5 L1.1 18.94,28.1 C14.1
SPI_CLK  (via drill 0.35)
  Top 0.152: U2.21 38.33,35.94 | 38.33,35.94 27.1,35.94 26.12,34.96 CC2652R1.16 | 38.33,35.94 39.24,36.85 v39.24,37.03
  Bottom 0.152: v39.24,37.03 39.24,40.77 TP_SPI_CLK.1
SPI_CS_TP  (via drill 0.35)
  Top 0.152: CC2652R1.12 27.9,32.81 v27.94,32.85 | v42.67,36.58 43.03,36.94 43.18,36.94 | U2.19 43.18,36.94 | 43.18,36.94 43.18,40.39 TP_SPI_CS.1
  Bottom 0.152: v27.94,32.85 38.95,32.85 v42.67,36.58
SPI_MISO  (via drill 0.35)
  Top 0.152: CC2652R1.14 26.34,33.96 26.92,34.54 30.89,34.54 31.5,33.93 37.78,33.93 | U2.25 39.88,33.93 37.78,33.93 | 37.78,33.93 v37.39,34.33
  Bottom 0.152: v37.39,34.33 37.39,40.84 TP_SPI_MISO.1
SPI_MOSI  (via drill 0.35)
  Top 0.152: CC2652R1.15 26.38,34.46 26.86,34.94 38.81,34.94 | U2.23 38.81,34.94 | 38.81,34.94 39.2,35.33 v39.29,35.33
  Bottom 0.152: v39.29,35.33 40.89,36.93 TP_SPI_MOSI.1
VCC  (via drill 0.35)
  Top 0.152: U2.31 46.33,30.58 45.72,29.97 | v43.18,30.48 43.69,29.97 45.72,29.97 | U2.26 43.09,33.44 v42.16,32.51 C1.1 | 45.72,29.97 47.24,28.45 53.85,28.45 56.9,31.5 56.9,39.12 52.83,43.18 48.87,43.18 45.83,40.13 U2.13
  Bottom 0.152: v43.18,30.48 42.16,31.5 v42.16,32.51
VDDR  (via drill 0.35)
  Top 0.152: 16.9,34.96 16.86,34.96 16.11,35.7 C9.1 15.79,35.8
  Top 0.254: L7.1 17.78,44.92 v17.78,45.72 18.46,46.4 C8.1 | CC2652R1.45 16.9,34.96 16.06,35.8 15.79,35.8 15.79,36.02 14.73,37.08 12.7,37.08 12.19,36.58 | CC2652R1.48 18.13,33.46 16.05,31.38 C10.1 12.19,31.94 12.19,36.58 | 12.19,36.58 11.68,37.08 v11.68,38.1
  Bottom 0.254: v11.68,38.1 11.68,40.13 17.3,45.72 v17.78,45.72
VDDS  (via drill 0.35)
  Top 0.152: CC2652R1.34 20,40.32 v19.05,41.27 | 14.22,43.5 R1.2 | C7.1 22.34,46.74 23.53,46.74 C6.1 | v11.18,45.72 11.66,45.23 POWER_IND.2 | CC2652R1.13 25.22,33.53 26.92,33.53 27.43,34.04 28.32,34.04 29.35,33.01 30.7,33.01 | CC2652R1.22 26.78,37.96 v26.92,38.1 | C4.1 31.82,38.61 v29.46,38.61 | C3.1 31.32,33.01 30.7,33.01 | v29.97,33.73 30.7,33.01
  Top 0.254: 22.34,46.74 21.07,48.01 L2.2 16.23,45.17 R_CS.P$1 | 12.76,45.17 POWER_IND.2 | 12.76,45.17 R_CS.P$1 | R_CS.P$1 14.22,44.92 14.22,43.5 | v11.18,45.72 11.73,45.17 12.76,45.17 | v9.65,42.67 12.7,39.62 v16.76,39.62 16.76,38.7 C5.1 16.18,37.02 17.74,35.46 CC2652R1.44
  Bottom 0.152: v16.76,39.62 18.41,41.27 v19.05,41.27 21.72,41.27 22.35,40.64 25.91,40.64 27.43,39.12 27.43,38.61 | 27.43,38.61 v26.92,38.1 26.92,36.07 29.26,33.73 v29.97,33.73 | v29.46,38.61 27.43,38.61
  Bottom 0.254: v11.18,45.72 9.65,44.2 v9.65,42.67
WMCU_RESET  (via drill 0.35)
  Top 0.152: v8.64,46.23 8.64,45.21 11.93,41.92 R2.1 12.95,42.43 R1.1 14.98,42.43 16.1,41.31 C20.1 16.3,41.31 | v25.15,46.69 25.15,47.55 28.33,50.74 J1.10
  Top 0.254: CC2652R1.35 19.5,40.1 19.1,40.5 17.4,40.5 16.59,41.31 16.3,41.31
  Bottom 0.152: v8.64,46.23 9.09,46.69 v25.15,46.69
WMCU_VDD
  Top 0.254: L2.1 15.99,49.53 3.3V.P$1 8.13,50.29 8.14,54.16 8.64,54.66 | 8.64,54.66 9.39,54.66 10.01,55.27 U1.5 | 8.64,54.66 7.92,55.37 C22.1

### Text on the board
tPlace: LED | LED | LED | LED | Axon Mobile rev1